# EAGLE design SunnyBuddy (EAGLE 7.3.0)
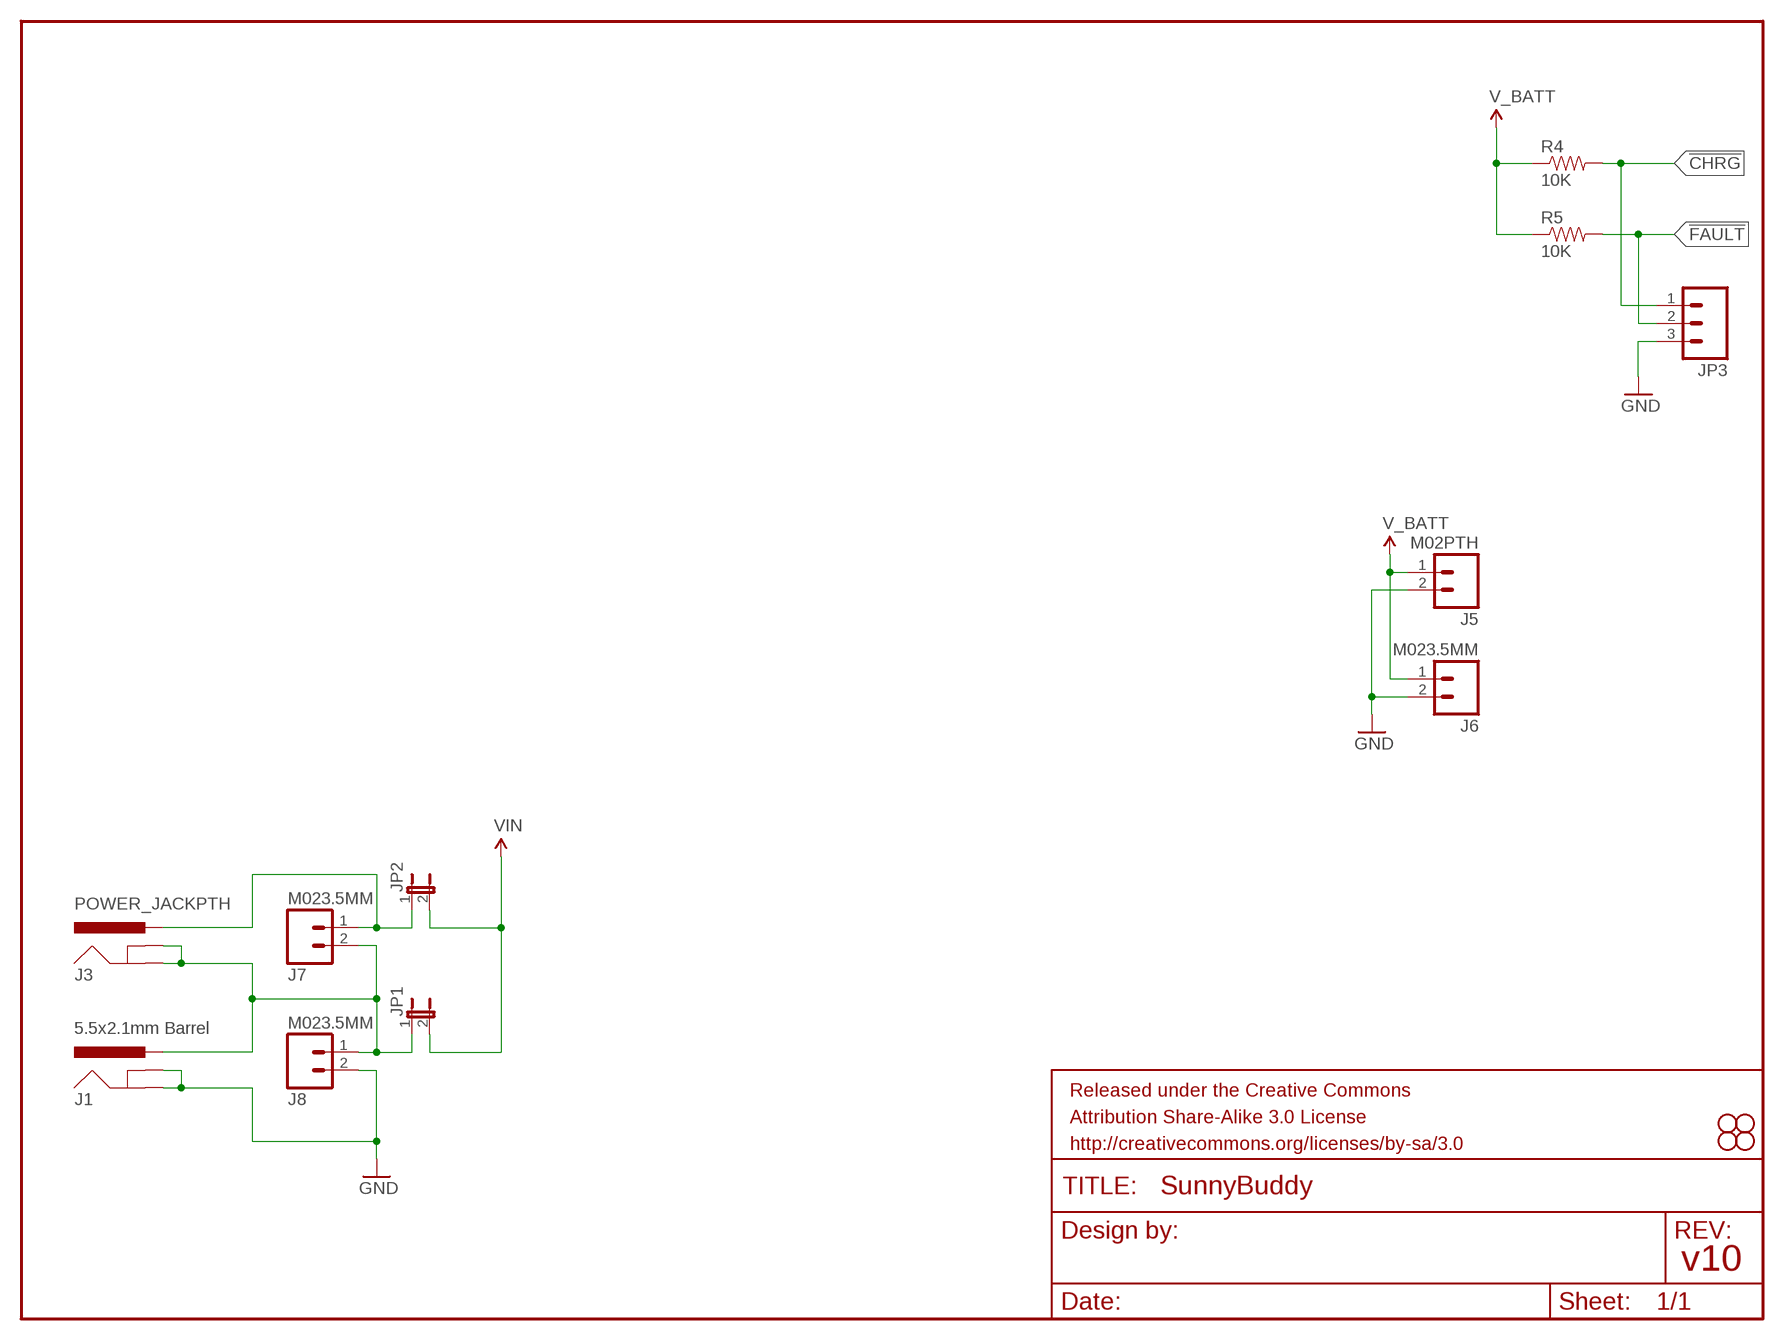
[diagram p0: schematic, sheet 1]

## Parts
FRAME1  FRAME-LETTER  [CREATIVE_COMMONS]
J1  5.5x2.1mm Barrel  POWER_JACKSMD  [POWER_JACK_SMD]
J3  POWER_JACKPTH  [POWER_JACK_PTH]
J5  M02PTH  [1X02]
J6  M023.5MM  [SCREWTERMINAL-3.5MM-2]
J7  M023.5MM  [SCREWTERMINAL-3.5MM-2]
J8  M023.5MM  [SCREWTERMINAL-3.5MM-2]
JP1  JUMPER-2SMD-NC  [SJ_2S]
JP2  JUMPER-2SMD-NO  [SJ_2S-NO]
JP3  M03PTH  [1X03]
R4  10K  10KOHM1/10W1%(0603)0603  [0603-RES]
R5  10K  10KOHM1/10W1%(0603)0603  [0603-RES]
STANDOFF1  STAND-OFF  [STAND-OFF]
STANDOFF2  STAND-OFF  [STAND-OFF]
STANDOFF3  STAND-OFF  [STAND-OFF]
STANDOFF4  STAND-OFF  [STAND-OFF]

## Nets
!CHRG: JP3.1 R4.2
!FAULT: JP3.2 R5.2
GND: J1.GND(GNDBREAK) J1.P$4(GND) J5.2 J6.2 J8.2 JP3.3
N$8: J1.VIN0(PWR) J3.GND J3.GNDBREAK J7.2 J8.1 JP1.1
SFSASDF: J3.PWR J7.1 JP2.1
V_BATT: J5.1 J6.1 R4.1 R5.1
VIN: JP1.2 JP2.2

## Notes on the sheet
- v10

## Library data of the parts
FRAME1 = SparkFun-Aesthetics:FRAME-LETTER: Schematic Frame Standard 8.5x11 US Letter frame
J1 = SparkFun-Connectors:POWER_JACK: Power Jack This is the standard 5.5mm barrel jack for power. The PTH is the most common, proven, reliable, footprint. The Slot footprint only works if the mill layer is transmitted to the PCB fab house so be warned. Spark Fun Electronics SKU : PRT-00119 SMT: CONN-08106 Mating wall wart : TOL-00298 (and others); PROD_ID: CONN-08106
J3 = SparkFun-Connectors:POWER_JACK: Power Jack This is the standard 5.5mm barrel jack for power. The PTH is the most common, proven, reliable, footprint. The Slot footprint only works if the mill layer is transmitted to the PCB fab house so be warned. Spark Fun Electronics SKU : PRT-00119 SMT: CONN-08106 Mating wall wart : TOL-00298 (and others)
J5-J8 = SparkFun-Connectors:M02: Standard 2-pin 0.1" header. Use with - straight break away headers ( PRT-00116) - right angle break away headers (PRT-00553) - swiss pins (PRT-00743) - machine pins (PRT-00117) - female headers (PRT-00115) Molex polarized connector foot print use with: PRT-08233 with associated crimp pins and housings. 2.54_SCREWTERM for use with PRT-10571. 3.5mm Screw Terminal footprints for PRT-08084 5mm Screw Terminal footprints for use with PRT-08433
JP1 JP2 = SparkFun-Passives:JUMPER-2: Jumper Basic 0.1" spaced jumper. Use with breakaway headers.
JP3 = SparkFun-Connectors:M03: Header 3 Standard 3-pin 0.1" header. Use with straight break away headers (SKU : PRT-00116), right angle break away headers (PRT-00553), swiss pins (PRT-00743), machine pins (PRT-00117), and female headers (PRT-00115). Molex polarized connector foot print use with SKU : PRT-08232 with associated crimp pins and housings.
R4 R5 = SparkFun-Resistors:10KOHM1/10W1%(0603): RES-00824; PROD_ID: RES-00824
STANDOFF1-STANDOFF4 = SparkFun-Electromechanical:STAND-OFF: #4 Stand Off This is the mechanical footprint for a #4 phillips button head screw. Use the keepout ring to avoid running the screw head into surrounding components. SKU : PRT-00447

## Board
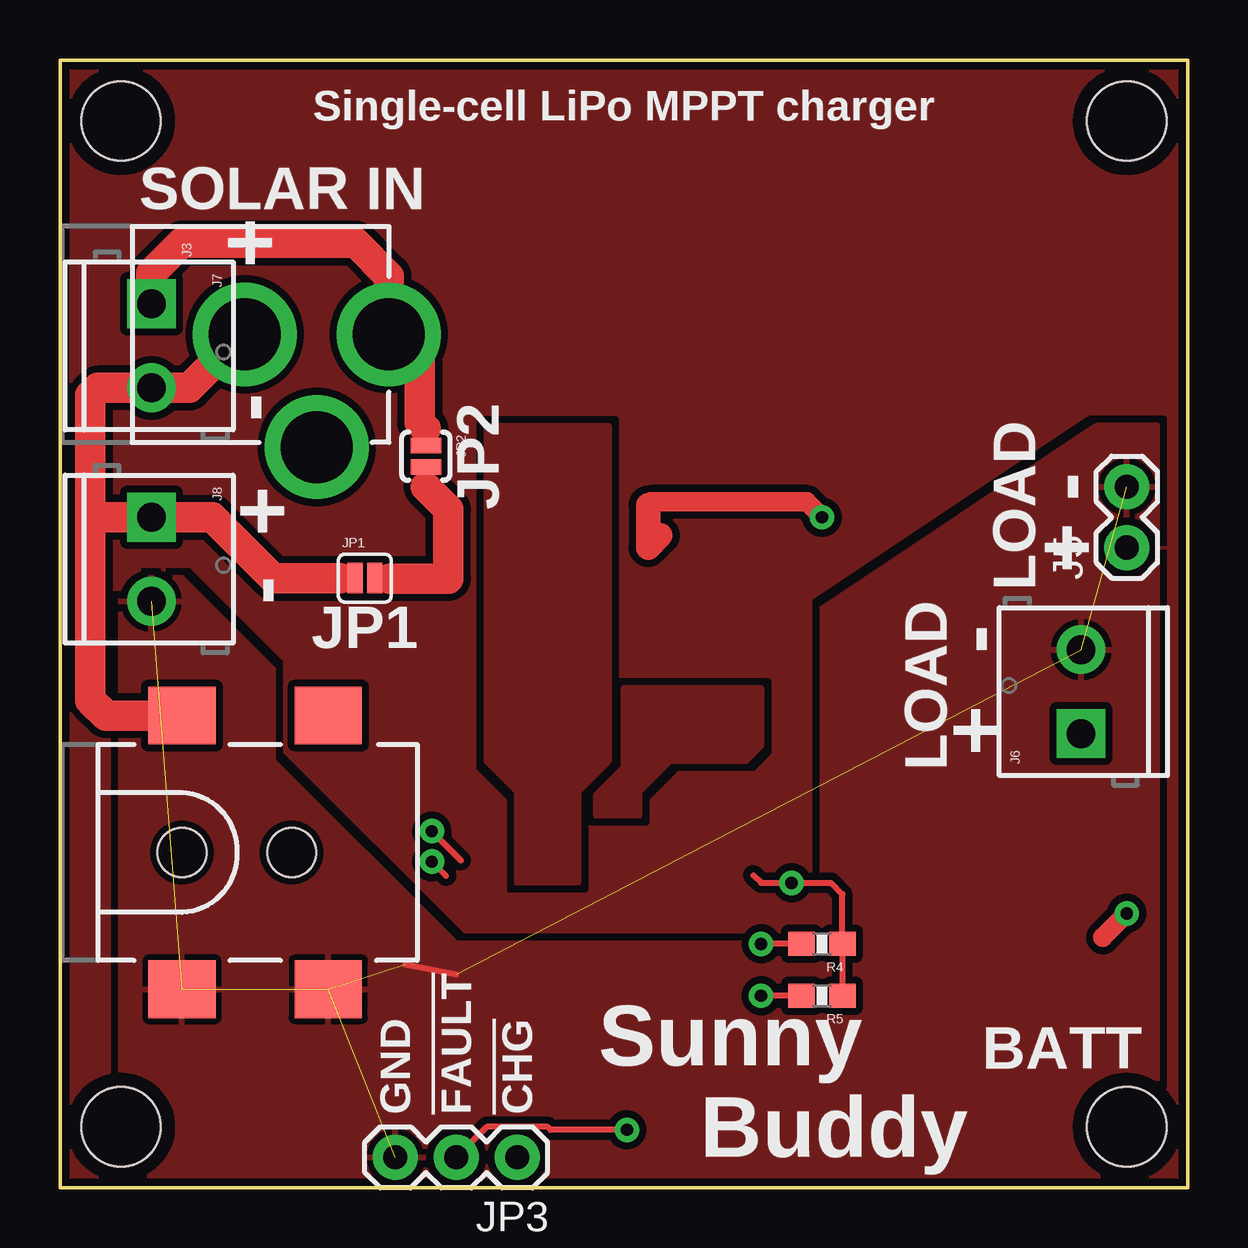
[diagram p1: board, top side]
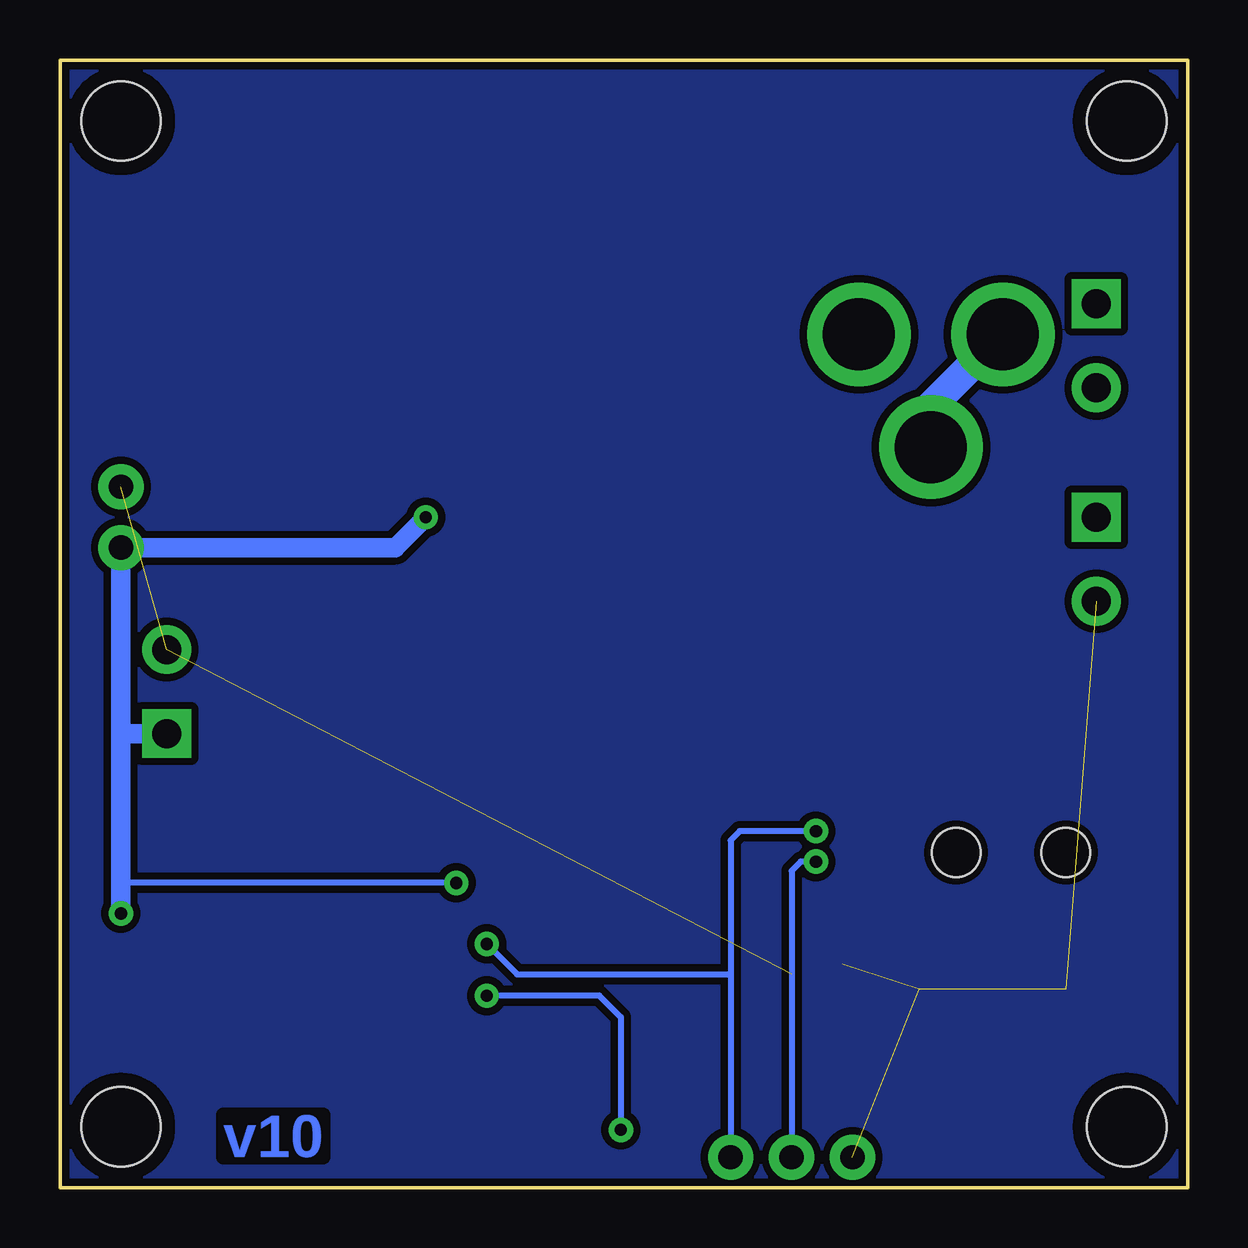
[diagram p2: board, bottom side, seen from below]

Size 46.99 x 46.99 mm. Coordinates in mm from the lower left corner, seen from the top.
Outline: 0,46.99 46.99,46.99 46.99,0 0,0 0,46.99
Copper layers (1*16): Top 0.035mm / dielectric 1.5mm / Bottom 0.035mm
Design rules "Sparkfun": minimum track width 8mil, minimum drill 20mil, track to track 8mil, track to pad 8mil, pad to pad 8mil, via to via 8mil, smd to smd 8mil, copper to edge 8mil, drill to drill 8mil, minimum pad ring 12mil, minimum via ring 10mil, stop-mask expansion 4mil, vias tented up to drill 20mil, thermal gap 10mil

### Footprints (pad centres in the part's own frame; a part is rotated, then mirrored left to right if it is on the bottom)
POWER_JACK_SMD = smd 2.8 x 2.4: GND 0,-5.7; P$4 6.1,-5.7; VIN0 0,5.7; VIN1 6.1,5.7 | hole 2.032: 0,0; 4.572,0
POWER_JACK_PTH = drill 2.997 pad 4.318: GND 0,7.7; GNDBREAK 4.7,10.7; PWR 0,13.7
1X02 = drill 1.016 pad 1.88: 1 0,0; 2 2.54,0
SCREWTERMINAL-3.5MM-2 = drill 1.2 pad 2.032 square: 1 0,0 | drill 1.2 pad 2.032: 2 3.5,0
SJ_2S = smd 0.635 x 1.27: 1 -0.412,0; 2 0.412,0
SJ_2S-NO = smd 0.635 x 1.27: 1 -0.45,0; 2 0.45,0
1X03 = drill 1.016 pad 1.88: 1 0,0; 2 2.54,0; 3 5.08,0
0603-RES = smd 1.1 x 1: 1 -0.85,0; 2 0.85,0
STAND-OFF = hole 3.302: 0,0

### Placement (x,y rotation side)
FRAME1  46.99,-26.67 0 top  (outside the outline)
J1  5.08,13.97 0 top
J3  0,35.56 270 top
J5  44.45,26.67 90 top
J6  42.55,18.92 90 top
J7  3.81,36.83 270 top
J8  3.81,27.94 270 top
JP1  12.7,25.4 0 top
JP2  15.24,30.48 270 top
JP3  19.05,1.27 180 top
R4  31.75,10.16 180 top
R5  31.75,8 180 top
STANDOFF1  2.54,2.54 0 top
STANDOFF2  2.54,44.45 0 top
STANDOFF3  44.45,44.45 0 top
STANDOFF4  44.45,2.54 0 top

### Tracks (layer width: path | path; a pad name or v marks a point on that pad's centre or on a via)
!CHRG  (via drill 0.51)
  Top 0.254: 16.71,13.64 v15.49,14.86 | R4.2 v29.21,10.16
  Bottom 0.254: v15.49,14.86 18.67,14.86 19.05,14.48 19.05,8.89 | 19.05,8.89 JP3.1 | 19.05,8.89 27.94,8.89 v29.21,10.16
!FAULT  (via drill 0.51)
  Top 0.254: 16.09,12.99 v15.49,13.59 | v23.62,2.41 20.45,2.41 20.32,2.54 17.78,2.54 JP3.2 | R5.2 v29.21,8
  Bottom 0.254: v15.49,13.59 16.13,13.59 16.51,13.21 JP3.2 | v23.62,2.41 23.62,7.11 24.51,8 v29.21,8
GND  (6 unrouted)
  Top 0.254: 14.39,9.31 16.51,8.89
  pour Top (isolate 0.305): 43.18,31.75 31.75,24.13 31.75,12.7 29.21,10.16 16.51,10.16 8.89,17.78 8.89,21.59 5.08,25.4 2.54,25.4 2.54,0 45.72,0 45.72,31.75
  pour Top (isolate 0.305): 22.86,31.75 22.86,17.78 21.59,16.51 21.59,12.7 19.05,12.7 19.05,16.51 17.78,17.78 17.78,31.75
N$1
  pour Top (isolate 0.305, rank 2, no thermals): 0,46.99 46.99,46.99 46.99,0 0,0
N$2
  pour Bottom (isolate 0.305, rank 2, no thermals): 0,46.99 46.99,46.99 46.99,0 0,0
N$8
  Top 0.254: J3.GND 7.62,35.56 | 11.68,25.4 JP1.1
  Top 1.27: 7.62,35.56 5.39,33.33 J7.2 1.58,33.33 1.27,33.02 1.27,27.94 | 1.27,27.94 1.27,20.32 1.92,19.67 J1.VIN0 | 11.68,25.4 8.89,25.4 6.35,27.94 J8.1 1.27,27.94
  Bottom 1.27: J3.GNDBREAK 10.7,32.56 J3.GND
SFSASDF
  Top 0.254: JP2.1 15.24,31.62
  Top 1.27: J7.1 3.81,38.1 5.08,39.37 12.32,39.37 13.7,37.99 J3.PWR 14.99,34.42 14.99,31.88 15.24,31.62
SW
  pour Top (isolate 0.305): 23.5,20.83 29.21,20.83 29.21,18.41 28.57,17.78 25.4,17.78 24.13,16.51 24.13,15.49 22.35,15.49 22.35,16.38 23.5,17.53
V_BATT  (via drill 0.51)
  Top 0.254: 28.89,13.02 29.21,12.7 v30.48,12.7 32.13,12.7 32.6,12.23 R4.1 R5.1
  Top 0.813: 43.45,10.43 v44.45,11.43 | 24.51,28.45 24.64,28.57 31.11,28.57 v31.75,27.94
  Top 1.016: 24.51,28.45 24.51,26.67 25.02,27.18
  Bottom 0.254: v30.48,12.7 44.45,12.7
  Bottom 0.813: v44.45,11.43 44.45,12.7 44.45,19.05 | 44.45,19.05 J5.1 33.02,26.67 v31.75,27.94 | J6.1 44.32,18.92 44.45,19.05
VIN
  Top 0.254: 13.73,25.39 13.72,25.4 JP1.2 | JP2.2 15.24,29.21
  Top 1.27: 13.73,25.39 16.18,25.39 16.18,28.27 15.24,29.21

### Text on the board
Bottom: v10
tPlace: Single-cell LiPo MPPT charger | SOLAR IN | + | - | JP2 | - | + | + | - | LOAD | - | JP1 | + | LOAD | BATT | Sunny | GND | !FAULT | !CHG | Buddy
tDocu: M. Hord